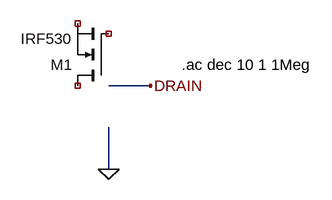
[diagram p0: schematic case_05.asc]
case_05.asc, the LTspice schematic file:
Version 4.1
SHEET 1 880 680
WIRE 608 352 672 352
WIRE 608 416 608 480
FLAG 672 352 DRAIN
FLAG 608 480 0
SYMBOL nmos 608 352 R180
SYMATTR InstName M1
SYMATTR Value IRF530
SYMATTR SpiceLine m=2
SYMATTR Type nmos
TEXT 720 320 Left 2 !.ac dec 10 1 1Meg

The netlist it stands for:
* case_05.asc
* M1: IRF530 m=2 (symbol nmos not certain, pin order unknown); nets seen at it: 
.ac dec 10 1 1Meg
.backanno
.end